# EAGLE design display-demo (EAGLE 4.16)
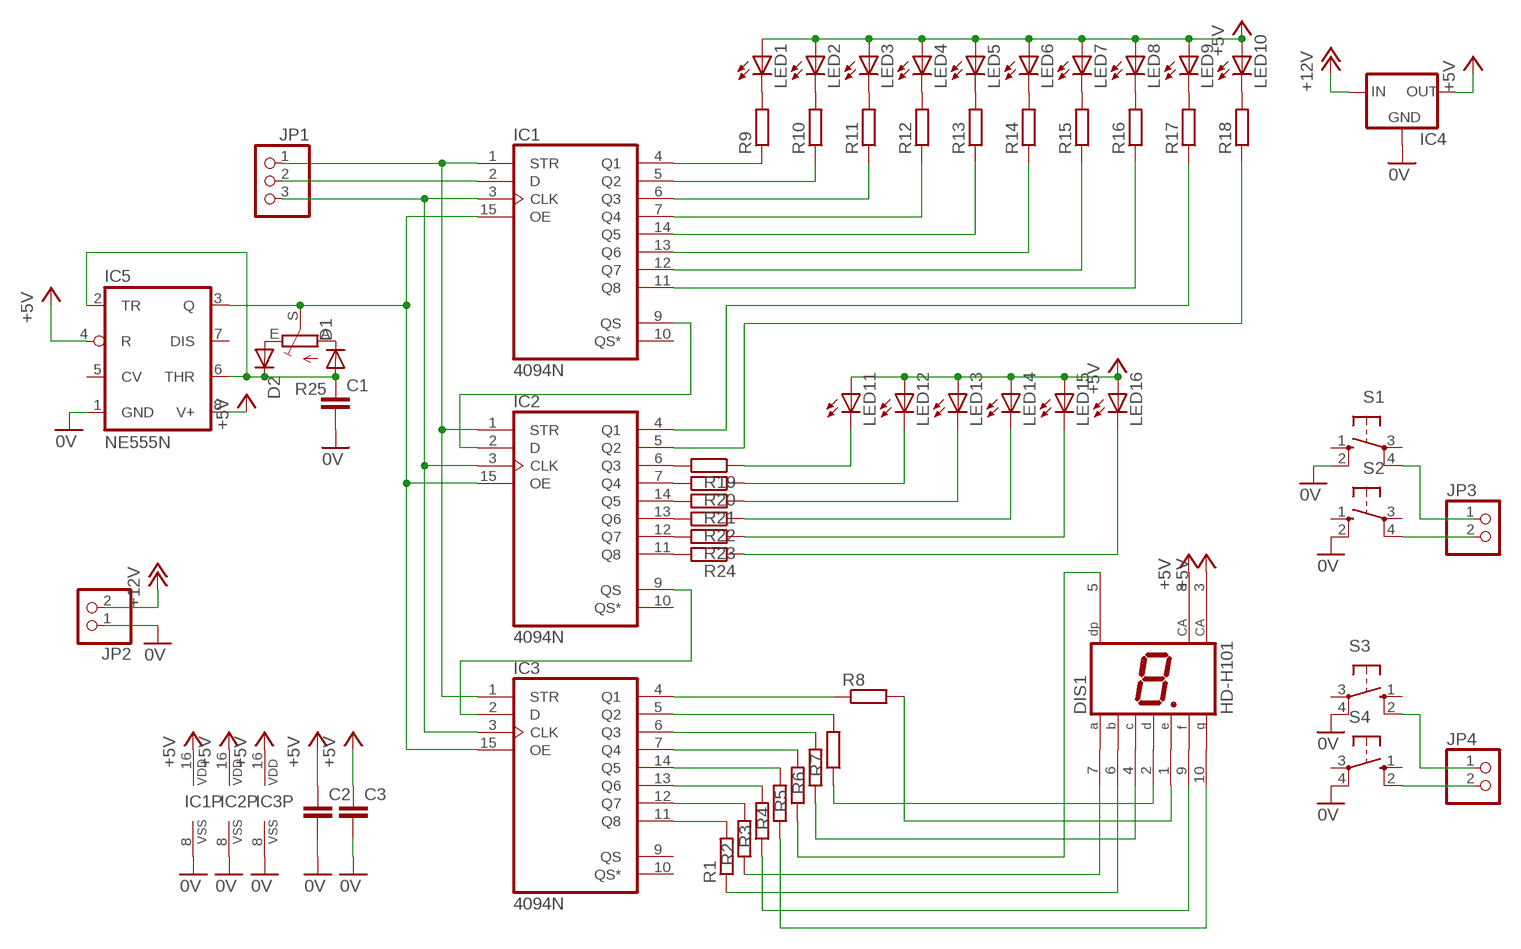
[diagram p0: schematic, sheet 1]

## Parts
C1  C-EU050-025X075  [C050-025X075]
C2  C-EU050-025X075  [C050-025X075]
C3  C-EU050-025X075  [C050-025X075]
D1  DIODE-D-5  [D-5]
D2  DIODE-D-5  [D-5]
DIS1  HD-H101  [HDSP-M]
IC1  4094N  [DIL16]
IC2  4094N  [DIL16]
IC3  4094N  [DIL16]
IC4  78XXL  [78XXL]
IC5  NE555N  [DIL08]
JP1  PINHD-1X3  [1X03]
JP2  PINHD-1X2  [1X02]
JP3  PINHD-1X2  [1X02]
JP4  PINHD-1X2  [1X02]
LED1  LED3MM  [LED3MM]
LED2  LED3MM  [LED3MM]
LED3  LED3MM  [LED3MM]
LED4  LED3MM  [LED3MM]
LED5  LED3MM  [LED3MM]
LED6  LED3MM  [LED3MM]
LED7  LED3MM  [LED3MM]
LED8  LED3MM  [LED3MM]
LED9  LED3MM  [LED3MM]
LED10  LED3MM  [LED3MM]
LED11  LED3MM  [LED3MM]
LED12  LED3MM  [LED3MM]
LED13  LED3MM  [LED3MM]
LED14  LED3MM  [LED3MM]
LED15  LED3MM  [LED3MM]
LED16  LED3MM  [LED3MM]
R1  R-EU_0204/7  [0204/7]
R2  R-EU_0204/7  [0204/7]
R3  R-EU_0204/7  [0204/7]
R4  R-EU_0204/7  [0204/7]
R5  R-EU_0204/7  [0204/7]
R6  R-EU_0204/7  [0204/7]
R7  R-EU_0204/7  [0204/7]
R8  R-EU_0204/7  [0204/7]
R9  R-EU_0204/7  [0204/7]
R10  R-EU_0204/7  [0204/7]
R11  R-EU_0204/7  [0204/7]
R12  R-EU_0204/7  [0204/7]
R13  R-EU_0204/7  [0204/7]
R14  R-EU_0204/7  [0204/7]
R15  R-EU_0204/7  [0204/7]
R16  R-EU_0204/7  [0204/7]
R17  R-EU_0204/7  [0204/7]
R18  R-EU_0204/7  [0204/7]
R19  R-EU_0204/7  [0204/7]
R20  R-EU_0204/7  [0204/7]
R21  R-EU_0204/7  [0204/7]
R22  R-EU_0204/7  [0204/7]
R23  R-EU_0204/7  [0204/7]
R24  R-EU_0204/7  [0204/7]
R25  TRIM_EU-PT10  [PT-10]
S1  10-XX  [B3F-10XX]
S2  10-XX  [B3F-10XX]
S3  10-XX  [B3F-10XX]
S4  10-XX  [B3F-10XX]

## Nets
0V: C1.2 C2.2 C3.2 IC1.8(VSS) IC2.8(VSS) IC3.8(VSS) IC4.GND IC5.1(GND) JP2.1 S1.2(S1) S2.2(S1) S3.4(P1) S4.4(P1)
+5V: C2.1 C3.1 DIS1.3(CA) DIS1.8(CA) IC1.16(VDD) IC2.16(VDD) IC3.16(VDD) IC4.OUT IC5.4(R) IC5.8(V+) LED1.A LED2.A LED3.A LED4.A LED5.A LED6.A LED7.A LED8.A LED9.A LED10.A LED11.A LED12.A LED13.A LED14.A LED15.A LED16.A
+12V: IC4.IN JP2.2
N$1: IC1.4(Q1) R9.1
N$2: IC1.5(Q2) R10.1
N$3: IC1.6(Q3) R11.1
N$4: IC1.7(Q4) R12.1
N$5: IC1.14(Q5) R13.1
N$6: IC1.13(Q6) R14.1
N$7: IC1.12(Q7) R15.1
N$8: IC1.11(Q8) R16.1
N$9: IC2.4(Q1) R17.1
N$10: IC2.5(Q2) R18.1
N$11: IC1.9(QS) IC2.2(D)
N$12: IC2.9(QS) IC3.2(D)
N$14: IC1.1(STR) IC2.1(STR) IC3.1(STR) JP1.1
N$15: DIS1.1(E) R8.2
N$16: DIS1.2(D) R7.1
N$17: DIS1.4(C) R6.1
N$18: D1.C R25.A
N$19: DIS1.6(B) R1.1
N$20: DIS1.7(A) R2.1
N$21: IC3.5(Q2) R7.2
N$22: IC3.4(Q1) R8.1
N$23: DIS1.9(F) R3.1
N$24: IC3.6(Q3) R6.2
N$25: IC3.7(Q4) R5.2
N$26: IC3.14(Q5) R4.2
N$27: IC3.13(Q6) R3.2
N$28: IC3.12(Q7) R2.2
N$29: IC3.11(Q8) R1.2
N$30: DIS1.5(DP) R5.1
N$31: LED1.K(C) R9.2
N$32: LED2.K(C) R10.2
N$33: LED3.K(C) R11.2
N$34: LED4.K(C) R12.2
N$35: LED5.K(C) R13.2
N$36: LED6.K(C) R14.2
N$37: LED7.K(C) R15.2
N$38: LED8.K(C) R16.2
N$39: LED9.K(C) R17.2
N$40: LED10.K(C) R18.2
N$41: JP3.2 S2.4(P1)
N$42: IC1.3(CLK) IC2.3(CLK) IC3.3(CLK) JP1.3
N$43: IC1.15(OE) IC2.15(OE) IC3.15(OE) IC5.3(Q) R25.S
N$44: IC2.6(Q3) R19.2
N$45: IC2.7(Q4) R20.2
N$46: IC2.14(Q5) R21.2
N$47: IC2.13(Q6) R22.2
N$48: IC2.12(Q7) R23.2
N$49: IC2.11(Q8) R24.2
N$50: LED16.K(C) R24.1
N$51: LED15.K(C) R23.1
N$52: LED14.K(C) R22.1
N$53: LED13.K(C) R21.1
N$54: LED12.K(C) R20.1
N$55: LED11.K(C) R19.1
N$56: JP3.1 S1.4(P1)
N$57: JP4.2 S4.2(S1)
N$58: JP4.1 S3.2(S1)
N$59: D2.A R25.E
N$61: DIS1.10(G) R4.1
N$62: C1.1 D1.A D2.C IC5.2(TR) IC5.6(THR)
N$67: IC1.2(D) JP1.2
Unconnected: IC1.10(QS*) IC2.10(QS*) IC3.9(QS) IC3.10(QS*) IC5.5(CV) IC5.7(DIS) S1.1(S) S1.3(P) S2.1(S) S2.3(P) S3.1(S) S3.3(P) S4.1(S) S4.3(P)

## Library data of the parts
C1-C3 = rcl:C-EU: CAPACITOR, European symbol
D1 D2 = diode:DIODE-: DIODE
DIS1 = display-hp:HD-H101: LED DISPLAY 1-character 7 segment, decimal point right
IC1-IC3 = 40xx:4094: 8-stage SHIFT/STORE REGISTER, tri-state
IC4 = v-reg:78XXL: VOLTAGE REGULATOR
IC5 = linear:*555: TIMER
JP1 = pinhead:PINHD-1X3: PIN HEADER
JP2-JP4 = pinhead:PINHD-1X2: PIN HEADER
LED1-LED16 = led:LED: LED OSRAM: - CHIPLED LG R971, LG N971, LY N971, LG Q971, LY Q971, LO R971, LY R971 LH N974, LH R974 LS Q976, LO Q976, LY Q976 LO Q996 - Hyper CHIPLED LW Q18S LB Q993, LB Q99A, LB R99A - SideLED LS A670, LO A670, LY A670, LG A670, LP A670 LB A673, LV A673, LT A673, LW A673 LH A674 LY A675 LS A676, LA A676, LO A676, LY A676, LW A676 LS A679, LY A679, LG A679 - Hyper Micro SIDELED® LS Y876, LA Y876, LO Y876, LY Y876 LT Y87S - SmartLED LW L88C, LW L88S LB L89C, LB L89S, LG L890 LS L89K, LO L89K, LY L89K LS L896, LA L896, LO L896, LY L896 - TOPLED LS T670, LO T670, LY T670, LG T670, LP T670 LSG T670, LSP T670, LSY T670, LOP T670, LYG T670 LG T671, LOG T671, LSG T671 LB T673, LV T673, LT T673, LW T673 LH T674 LS T676, LA T676, LO T676, LY T676, LB T676, LH T676, LSB T676, LW T676 LB T67C, LV T67C, LT T67C, LS T67K, LO T67K, LY T67K, LW E67C LS E67B, LA E67B, LO E67B, LY E67B, LB E67C, LV E67C, LT E67C LW T67C LS T679, LY T679, LG T679 LS T770, LO T770, LY T770, LG T770, LP T770 LB T773, LV T773, LT T773, LW T773 LH T774 LS E675, LA E675, LY E675, LS T675 LS T776, LA T776, LO T776, LY T776, LB T776 LHGB T686 LT T68C, LB T68C - Hyper Mini TOPLED® LB M676 - Mini TOPLED Santana® LG M470 LS M47K, LO M47K, LY M47K Source: http://www.osram.convergy.de/
R1-R24 = rcl:R-EU_: RESISTOR, European symbol
R25 = pot:TRIM_EU-: POTENTIOMETER
S1-S4 = switch-omron:10-XX: OMRON SWITCH

## Board
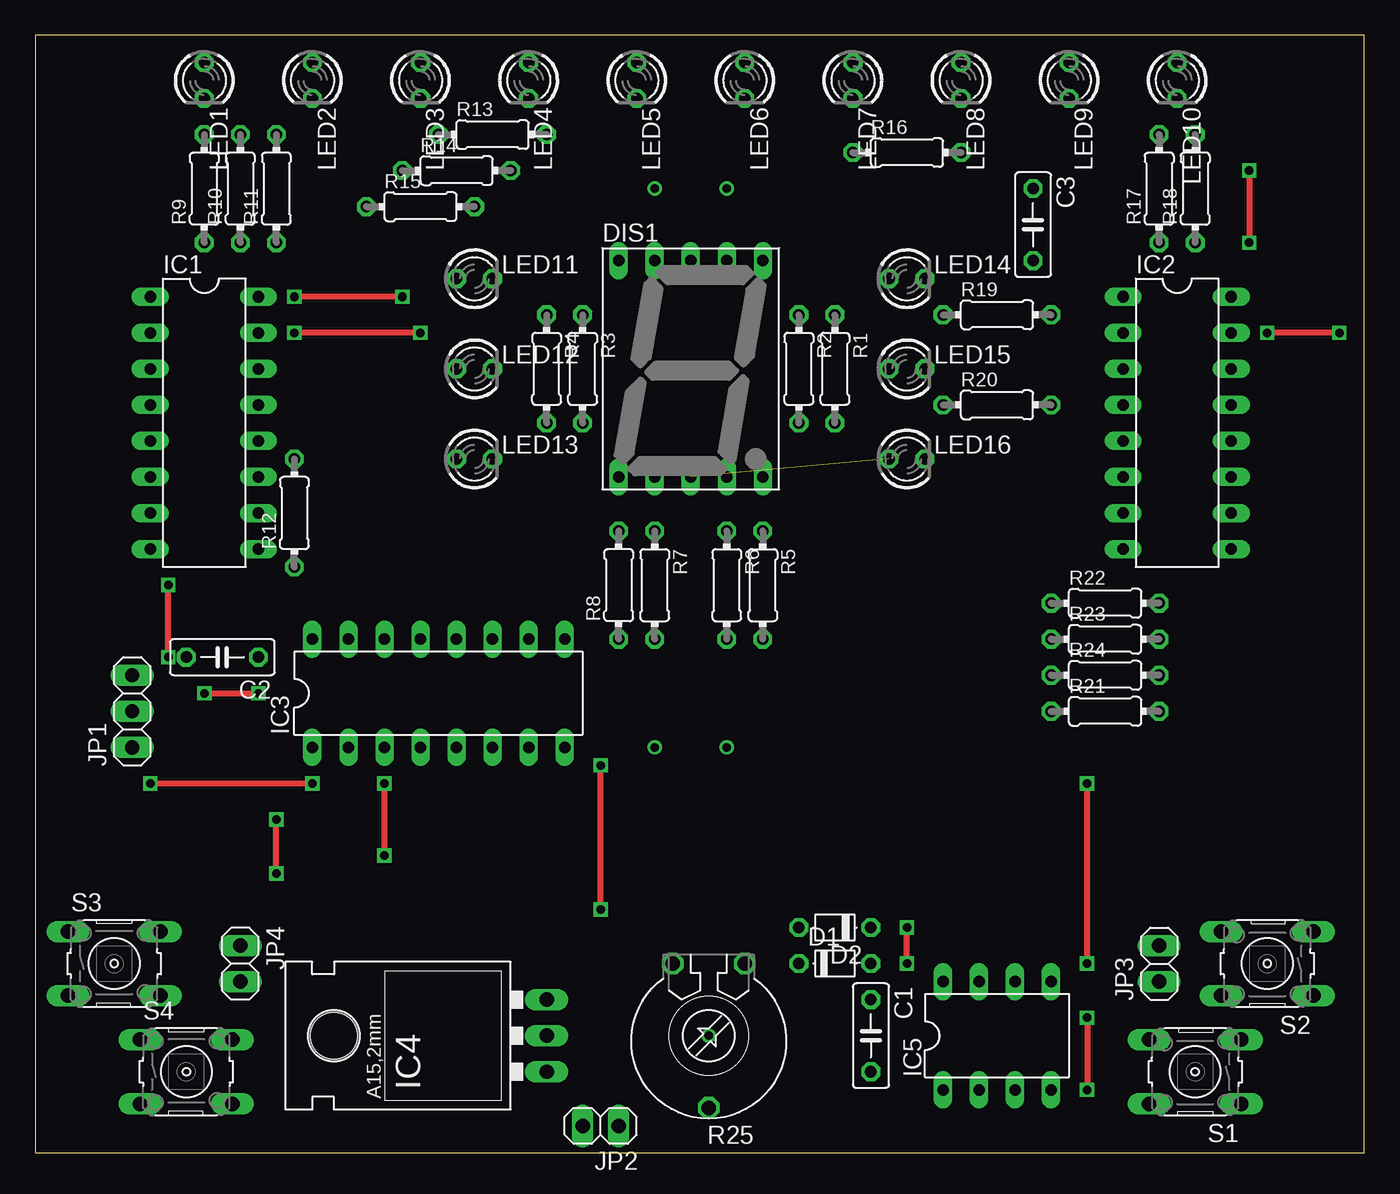
[diagram p1: board, top side]
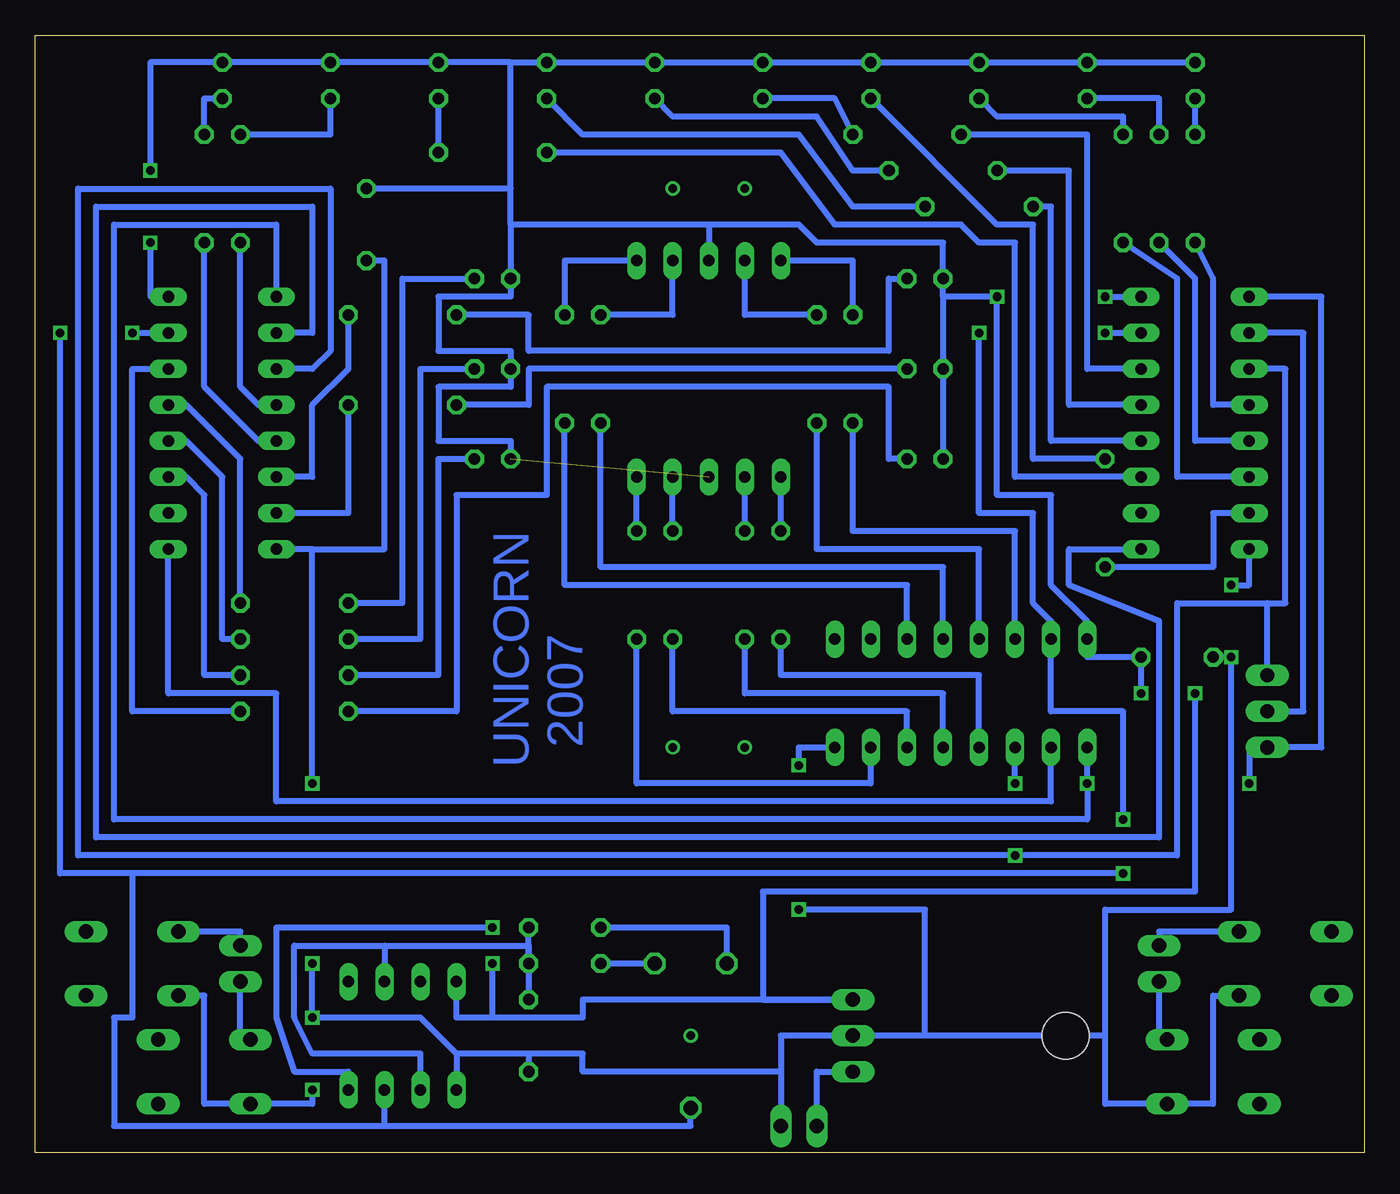
[diagram p2: board, bottom side, seen from below]

Size 93.65 x 78.73 mm. Coordinates in mm from the lower left corner, seen from the top.
Outline: 0,0 93.65,0 93.65,78.73 0,78.73 0,0
Copper layers (1*16): Top 0.035mm / dielectric 1.5mm / Bottom 0.035mm
Design rules "default": minimum track width 10mil, minimum drill 24mil, track to track 8mil, track to pad 8mil, pad to pad 8mil, via to via 8mil, smd to smd 8mil, copper to edge 40mil, drill to drill 8mil, minimum pad ring 10mil, minimum via ring 8mil, stop-mask expansion 4mil, vias tented up to drill 0mil, thermal gap 10mil

### Footprints (pad centres in the part's own frame; a part is rotated, then mirrored left to right if it is on the bottom)
C050-025X075 = drill 0.813 octagon: 1 -2.54,0; 2 2.54,0
D-5 = drill 0.813 octagon: A 2.54,0; C -2.54,0
HDSP-M = drill 0.813 long: 1 -5.08,-7.62; 2 -2.54,-7.62; 3 0,-7.62; 4 2.54,-7.62; 5 5.08,-7.62; 6 5.08,7.62; 7 2.54,7.62; 8 0,7.62; 9 -2.54,7.62; 10 -5.08,7.62
DIL16 = drill 0.813 long: 1 -8.89,-3.81; 2 -6.35,-3.81; 3 -3.81,-3.81; 4 -1.27,-3.81; 5 1.27,-3.81; 6 3.81,-3.81; 7 6.35,-3.81; 8 8.89,-3.81; 9 8.89,3.81; 10 6.35,3.81; 11 3.81,3.81; 12 1.27,3.81; 13 -1.27,3.81; 14 -3.81,3.81; 15 -6.35,3.81; 16 -8.89,3.81
78XXL = drill 1.016 long: GND 0,-3.81; IN -2.54,-3.81; OUT 2.54,-3.81 | hole 3.302: 0,11.176
DIL08 = drill 0.813 long: 1 -3.81,-3.81; 2 -1.27,-3.81; 3 1.27,-3.81; 4 3.81,-3.81; 5 3.81,3.81; 6 1.27,3.81; 7 -1.27,3.81; 8 -3.81,3.81
1X03 = drill 1.016 long: 1 -2.54,0; 2 0,0; 3 2.54,0
1X02 = drill 1.016 long: 1 -1.27,0; 2 1.27,0
LED3MM = drill 0.813 octagon: A -1.27,0; K 1.27,0
0204/7 = drill 0.813 octagon: 1 -3.81,0; 2 3.81,0
PT-10 = drill 1.016 octagon: A -2.54,-5.08; E 2.54,-5.08; S 0,5.08
B3F-10XX = drill 1.016 long: 1 -3.251,2.261; 2 3.251,2.261; 3 -3.251,-2.261; 4 3.251,-2.261

### Placement (x,y rotation side)
C1  58.89,8.25 270 top
C2  13.17,34.92 180 top
C3  70.32,65.4 270 top
D1  56.35,13.33 0 top
D2  56.35,15.87 180 top
DIS1  46.19,55.24 0 top
IC1  11.9,51.43 270 top
IC2  80.48,51.43 270 top
IC3  28.41,32.38 0 top
IC4  32.22,8.25 90 top
IC5  67.78,8.25 0 top
JP1  6.82,31.11 90 top
JP2  39.84,1.9 180 top
JP3  79.21,13.33 90 top
JP4  14.44,13.33 270 top
LED1  11.9,75.56 270 top
LED2  19.52,75.56 270 top
LED3  27.14,75.56 270 top
LED4  34.76,75.56 270 top
LED5  42.38,75.56 270 top
LED6  50,75.56 270 top
LED7  57.62,75.56 270 top
LED8  65.24,75.56 270 top
LED9  72.86,75.56 270 top
LED10  80.48,75.56 270 top
LED11  30.95,61.59 0 top
LED12  30.95,55.24 0 top
LED13  30.95,48.89 0 top
LED14  61.43,61.59 0 top
LED15  61.43,55.24 0 top
LED16  61.43,48.89 0 top
R1  56.35,55.24 270 top
R2  53.81,55.24 270 top
R3  38.57,55.24 270 top
R4  36.03,55.24 270 top
R5  51.27,40 270 top
R6  48.73,40 270 top
R7  43.65,40 270 top
R8  41.11,40 90 top
R9  11.9,67.94 90 top
R10  14.44,67.94 90 top
R11  16.98,67.94 90 top
R12  18.25,45.08 90 top
R13  32.22,71.75 0 top
R14  29.68,69.21 0 top
R15  27.14,66.67 0 top
R16  61.43,70.48 0 top
R17  79.21,67.94 90 top
R18  81.75,67.94 90 top
R19  67.78,59.05 0 top
R20  67.78,52.7 0 top
R21  75.4,31.11 0 top
R22  75.4,38.73 0 top
R23  75.4,36.19 0 top
R24  75.4,33.65 0 top
R25  47.46,8.25 180 top
S1  81.75,5.71 180 top
S2  86.83,13.33 180 top
S3  5.55,13.33 0 top
S4  10.63,5.71 0 top

### Tracks (layer width: path | path; a pad name or v marks a point on that pad's centre or on a via)
0V  (via drill 0.6)
  Top 0.406: v9.36,34.92 v9.36,40 | v74.13,13.33 v74.13,26.03 | v39.84,17.14 v39.84,27.3 | v74.13,9.52 v74.13,4.44
  Bottom 0.406: 74.13,42.54 IC2.8 | 41.11,5.71 JP2.1 | 18.25,8.25 18.25,3.45 S4.4 10.63,3.45 10.63,11.07 S3.4 | 18.25,8.25 v20.79,8.25 30.95,8.25 | 30.95,8.25 IC4.GND 41.11,8.25 41.11,5.71 | 41.11,5.71 55.08,5.71 55.08,6.98 58.89,6.98 | 58.89,6.98 C1.2 | 58.89,6.98 63.97,6.98 | 63.97,6.98 66.51,9.52 v74.13,9.52 v74.13,13.33 | 63.97,6.98 IC5.1 | v9.36,40 8.09,40 IC1.8 | v74.13,26.03 74.13,42.54 | 18.25,8.25 18.25,17.14 9.36,17.14 v9.36,34.92 C2.2 | IC3.8 39.84,28.57 v39.84,27.3 | v39.84,17.14 30.95,17.14 30.95,8.25 | 74.13,42.54 69.05,42.54 69.05,62.86 C3.2 | S2.2 81.75,11.07 81.75,3.45 S1.2 74.13,3.45 v74.13,4.44
+5V  (via drill 0.6)  (1 unrouted)
  Top 0.406: v25.87,60.32 v18.25,60.32 | v85.56,69.21 v85.56,64.13 | v11.9,32.38 v15.71,32.38 | v61.43,13.33 v61.43,15.87
  Bottom 0.406: LED2.A LED1.A | LED3.A LED2.A | LED4.A LED3.A | LED5.A LED4.A | LED6.A LED5.A | LED7.A LED6.A | LED8.A LED9.A | LED9.A LED10.A 85.56,76.83 v85.56,69.21 | LED3.A LED2.A | LED4.A LED3.A | LED5.A LED4.A | LED6.A LED5.A | LED7.A LED6.A | 60.16,76.83 LED7.A | 60.16,76.83 LED8.A | LED8.A LED9.A | LED13.A LED12.A 29.68,60.32 | 46.19,65.4 39.84,65.4 38.57,64.13 29.68,64.13 LED11.A 29.68,60.32 | 46.19,65.4 DIS1.8 | 60.16,65.4 LED14.A 60.16,60.32 65.24,60.32 65.24,56.51 60.16,56.51 LED15.A 60.16,53.97 65.24,53.97 65.24,50.16 60.16,50.16 LED16.A | 46.19,65.4 60.16,65.4 | 61.43,9.52 55.08,9.52 55.08,10.79 IC4.OUT 42.38,10.79 42.38,18.41 11.9,18.41 v11.9,32.38 | 61.43,9.52 63.97,9.52 IC5.8 | 60.16,65.4 60.16,67.94 | 60.16,67.94 60.16,76.83 | v18.25,60.32 IC1.16 | IC2.16 85.56,60.32 v85.56,64.13 | 29.68,60.32 v25.87,60.32 25.87,46.35 22.06,46.35 22.06,40 19.52,37.46 IC3.16 19.52,34.92 C2.1 v15.71,32.38 | 60.16,67.94 C3.1 | IC5.4 71.59,5.71 75.4,5.71 76.67,9.52 76.67,15.87 v61.43,15.87 | 61.43,9.52 v61.43,13.33
+12V
  Bottom 0.406: JP2.2 38.57,5.71 IC4.IN
N$1
  Bottom 0.406: IC1.4 10.63,52.7 10.63,61.59 R9.1
N$2
  Bottom 0.406: R10.1 11.9,61.59 11.9,50.16 IC1.5
N$3
  Bottom 0.406: R11.1 13.17,61.59 13.17,47.62 IC1.6
N$4
  Bottom 0.406: R12.1 10.63,41.27 10.63,45.08 IC1.7
N$5
  Bottom 0.406: R13.1 19.52,71.75 19.52,55.24 IC1.14
N$6
  Bottom 0.406: R14.1 20.79,69.21 20.79,52.7 IC1.13
N$7
  Bottom 0.406: R15.1 22.06,66.67 22.06,50.16 IC1.12
N$8
  Bottom 0.406: R16.1 41.11,70.48 37.3,65.4 28.41,65.4 27.14,64.13 24.6,64.13 24.6,47.62 IC1.11
N$9
  Bottom 0.406: R17.1 79.21,53.97 77.94,52.7 IC2.4
N$10
  Bottom 0.406: R18.1 81.75,53.97 77.94,50.16 IC2.5
N$11
  Bottom 0.406: IC2.2 74.13,57.78 74.13,66.67 89.37,66.67 89.37,22.22 14.44,22.22 14.44,37.46 20.79,40 20.79,42.54 IC1.9
N$12
  Bottom 0.406: IC3.2 22.06,24.76 76.67,24.76 76.67,32.38 84.29,32.38 IC2.9
N$14  (via drill 0.6)
  Top 0.406: v8.09,26.03 v19.52,26.03
  Bottom 0.406: IC2.1 76.67,65.4 88.1,65.4 88.1,23.49 19.52,23.49 v19.52,26.03 IC3.1 | IC1.1 3.01,60.32 3.01,28.57 JP1.1 8.09,28.57 v8.09,26.03
N$15
  Bottom 0.406: R8.2 DIS1.1
N$16
  Bottom 0.406: R7.1 DIS1.2
N$17
  Bottom 0.406: R6.1 DIS1.4
N$18
  Bottom 0.406: R25.A D1.C
N$19
  Bottom 0.406: R1.1 56.35,62.86 DIS1.6
N$20
  Bottom 0.406: R2.1 48.73,59.05 DIS1.7
N$21
  Bottom 0.406: IC3.5 29.68,32.38 43.65,32.38 R7.2
N$22
  Bottom 0.406: IC3.4 27.14,33.65 41.11,33.65 R8.1
N$23
  Bottom 0.406: R3.1 43.65,59.05 DIS1.9
N$24
  Bottom 0.406: IC3.6 32.22,31.11 48.73,31.11 R6.2
N$25
  Bottom 0.406: IC3.7 34.76,26.03 51.27,26.03 R5.2
N$26
  Bottom 0.406: IC3.14 24.6,43.81 36.03,43.81 R4.2
N$27
  Bottom 0.406: IC3.13 27.14,42.54 38.57,42.54 R3.2
N$28
  Bottom 0.406: IC3.12 29.68,41.27 53.81,41.27 R2.2
N$29
  Bottom 0.406: IC3.11 32.22,40 56.35,40 R1.2
N$30
  Bottom 0.406: R5.1 DIS1.5
N$31
  Bottom 0.406: R9.2 LED1.K
N$32
  Bottom 0.406: R10.2 14.44,74.29 LED2.K
N$33
  Bottom 0.406: R11.2 16.98,73.02 25.87,73.02 LED3.K
N$34
  Bottom 0.406: LED4.K 25.87,65.4 23.33,65.4 23.33,48.89 R12.2
N$35
  Bottom 0.406: R13.2 37.3,74.29 LED5.K
N$36
  Bottom 0.406: R14.2 36.03,69.21 38.57,73.02 48.73,73.02 LED6.K
N$37
  Bottom 0.406: R15.2 36.03,66.67 39.84,71.75 55.08,71.75 LED7.K
N$38
  Bottom 0.406: R16.2 LED8.K
N$39
  Bottom 0.406: LED9.K 72.86,71.75 R17.2
N$40
  Bottom 0.406: LED10.K 81.75,74.29 R18.2
N$41
  Bottom 0.406: S2.4 79.21,15.59 JP3.2
N$42  (via drill 0.6)
  Top 0.406: v24.6,20.95 v24.6,26.03
  Bottom 0.406: IC1.3 5.55,55.24 5.55,38.73 | 5.55,38.73 13.17,38.73 13.17,20.95 v24.6,20.95 90.64,20.95 90.64,67.94 72.86,67.94 72.86,56.51 74.13,55.24 IC2.3 | v24.6,26.03 IC3.3 | JP1.3 6.82,38.73 5.55,38.73
N$43  (via drill 0.6)
  Top 0.406: v27.14,57.78 v18.25,57.78 | v91.91,57.78 v86.83,57.78 | v16.98,19.68 v16.98,23.49
  Bottom 0.406: R25.S 47.46,1.9 69.05,1.9 | 69.05,1.9 IC5.3 | v27.14,57.78 27.14,45.08 23.33,45.08 23.33,38.73 22.06,37.46 IC3.15 22.06,31.11 16.98,31.11 v16.98,23.49 | v18.25,57.78 IC1.15 | v86.83,57.78 IC2.15 | v91.91,57.78 91.91,19.68 86.83,19.68 | v16.98,19.68 86.83,19.68 | 86.83,19.68 86.83,9.52 88.1,9.52 88.1,1.9 69.05,1.9
N$44
  Bottom 0.406: R19.2 71.59,55.24 74.13,52.7 74.13,47.62 IC2.6
N$45
  Bottom 0.406: R20.2 71.59,45.08 IC2.7
N$46
  Bottom 0.406: R21.2 86.83,31.11 86.83,55.24 IC2.14
N$47
  Bottom 0.406: R22.2 79.21,48.89 83.02,52.7 IC2.13
N$48
  Bottom 0.406: R23.2 80.48,36.19 80.48,47.62 83.02,50.16 IC2.12
N$49
  Bottom 0.406: R24.2 81.75,33.65 81.75,46.35 83.02,47.62 IC2.11
N$50
  Bottom 0.406: LED16.K 65.24,48.89 65.24,33.65 R24.1
N$51
  Bottom 0.406: LED15.K 66.51,55.24 66.51,36.19 R23.1
N$52
  Bottom 0.406: LED14.K 67.78,61.59 67.78,38.73 R22.1
N$53
  Bottom 0.406: LED13.K 33.49,48.89 33.49,53.97 57.62,53.97 57.62,46.35 63.97,46.35 63.97,31.11 R21.1
N$54
  Bottom 0.406: LED12.K 58.89,55.24 58.89,52.7 R20.1
N$55
  Bottom 0.406: LED11.K 33.49,61.59 33.49,56.51 58.89,56.51 58.89,59.05 R19.1
N$56
  Bottom 0.406: S1.4 79.21,7.97 JP3.1
N$57
  Bottom 0.406: S4.2 14.44,7.97 JP4.2
N$58
  Bottom 0.406: S3.2 14.44,15.59 JP4.1
N$59
  Bottom 0.406: D2.A 44.92,15.87 R25.E
N$60  (via drill 0.6)
  other vias: 47.46,8.25
N$61
  Bottom 0.406: R4.1 36.03,62.86 DIS1.10
N$62
  Bottom 0.406: D1.A D2.C | D1.A C1.1 | 69.05,14.6 58.89,14.6 D1.A | 69.05,14.6 IC5.6 | 69.05,14.6 75.4,14.6 75.4,9.52 74.13,6.98 66.51,6.98 IC5.2
N$63  (via drill 0.6)
  other vias: 43.65,28.57
N$64  (via drill 0.6)
  other vias: 48.73,28.57
N$65  (via drill 0.6)
  other vias: 48.73,67.94
N$66  (via drill 0.6)
  other vias: 43.65,67.94
N$67
  Bottom 0.406: JP1.2 4.28,31.11 4.28,57.78 IC1.2

### Text on the board
Bottom: UNICORN | 2007